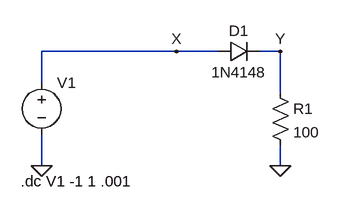
[diagram p0: schematic diode.asc]
diode.asc, the LTspice schematic file:
Version 4
SHEET 1 880 680
WIRE 160 128 -48 128
WIRE 224 128 160 128
WIRE 320 128 288 128
WIRE -48 176 -48 128
WIRE 320 192 320 128
WIRE -48 304 -48 256
WIRE 320 304 320 272
FLAG -48 304 0
FLAG 320 304 0
FLAG 320 128 Y
FLAG 160 128 X
SYMBOL diode 224 144 R270
WINDOW 0 32 32 VTop 2
WINDOW 3 0 32 VBottom 2
SYMATTR InstName D1
SYMATTR Value 1N4148
SYMBOL voltage -48 160 R0
WINDOW 123 0 0 Left 0
WINDOW 39 0 0 Left 0
SYMATTR InstName V1
SYMATTR Value ""
SYMBOL res 304 176 R0
SYMATTR InstName R1
SYMATTR Value 100
TEXT -80 328 Left 2 !.dc V1 -1 1 .001

The netlist it stands for:
* diode.asc
D1 X Y 1N4148
V1 X 0
R1 Y 0 100
.model D D
.lib standard.dio
.dc V1 -1 1 .001
.backanno
.end